# EAGLE design Teensy3 based M&M board V4 (EAGLE 6.5.0)
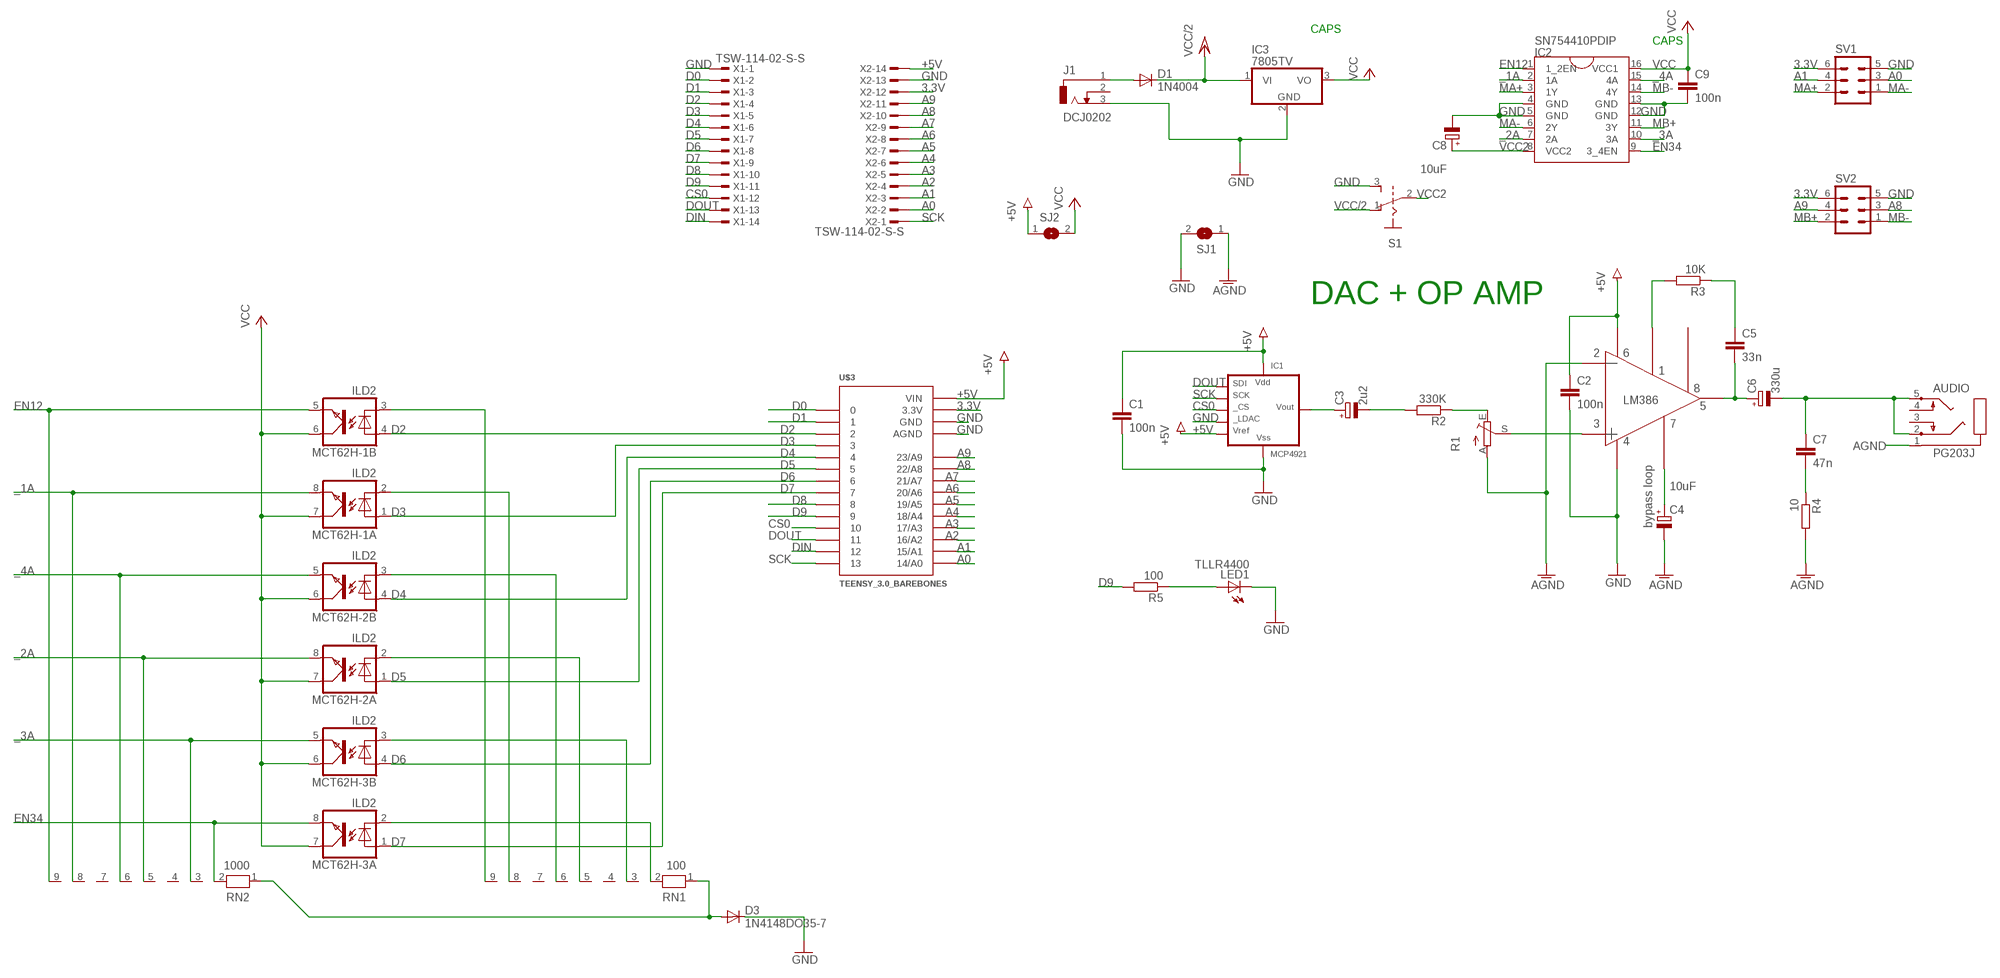
[diagram p0: schematic, sheet 1]

## Parts
AUDIO  PG203J  [PG203J]
C1  100n  C-EU050-030X075  [C050-030X075]
C2  100n  C-EU050-030X075  [C050-030X075]
C3  2u2  CPOL-EUE2-5  [E2-5]
C4  10uF  CPOL-EUE2-5  [E2-5]
C5  33n  C-EU050-030X075  [C050-030X075]
C6  330u  CPOL-EUE2.5-7  [E2,5-7]
C7  47n  C-EU050-030X075  [C050-030X075]
C8  10uF  CPOL-EUE2-5  [E2-5]
C9  100n  C-EU050-030X075  [C050-030X075]
D1  1N4004  [DO41-10]
D3  1N4148DO35-7  [DO35-7]
IC1  MCP4921  MCP4921P  [DIL8]
IC2  SN754410PDIP  [DIL16]
IC3  7805TV  [TO220V]
J1  DCJ0202  [DCJ0202]
LED1  TLLR4400  [LED3MM]
MCT62H-1  ILD2  [DIL08]
MCT62H-2  ILD2  [DIL08]
MCT62H-3  ILD2  [DIL08]
R1  TRIM_EU-CA9V  [CA9V]
R2  330K  R-EU_0207/10  [0207/10]
R3  10K  R-EU_0207/10  [0207/10]
R4  10  R-EU_0207/10  [0207/10]
R5  100  R-EU_0207/10  [0207/10]
RN1  100  RN08  [RN-9]
RN2  1000  RN08  [RN-9]
S1  EG1218  [GF-126-0159]
SJ1  SJ  [SJ]
SJ2  SJ  [SJ]
SV1  ML6  [ML6]
SV2  ML6  [ML6]
U$2  LM386  LM386OA  [LM386]
U$3  TEENSY_3.0_BAREBONES  [TEENSY_3.0_BAREBONES]
X1  TSW-114-02-S-S  [TSW-114-02-S-S]
X2  TSW-114-02-S-S  [TSW-114-02-S-S]

## Nets
3.3V [power]: SV1.6 SV2.6 U$3.3.3V X2.12
+5V [power]: C1.1 C2.1 IC1.1(VDD) IC1.6(VREF) SJ2.1 U$2.6 U$3.VIN X2.14
_1A: IC2.2(1A) MCT62H-1.8(A:EMIT) RN2.8
_2A: IC2.7(2A) MCT62H-2.8(A:EMIT) RN2.5
_3A: IC2.10(3A) MCT62H-3.5(B:EMIT) RN2.3
_4A: IC2.15(4A) MCT62H-2.5(B:EMIT) RN2.6
A0: SV1.3 U$3.14/A0 X2.2
A1: SV1.4 U$3.15/A1 X2.3
A2: U$3.16/A2 X2.4
A3: U$3.17/A3 X2.5
A4: U$3.18/A4 X2.6
A5: U$3.19/A5 X2.7
A6: U$3.20/A6 X2.8
A7: U$3.21/A7 X2.9
A8: SV2.3 U$3.22/A8 X2.10
A9: SV2.4 U$3.23/A9 X2.11
AGND [power]: AUDIO.1 C4.- R1.A R4.2 SJ1.1 U$2.2
AMP_IN: R1.S U$2.3
CS0: IC1.2(CS) U$3.10 X1.12
D0: U$3.0 X1.2
D1: U$3.1 X1.3
D2: MCT62H-1.4(B:A) U$3.2 X1.4
D3: MCT62H-1.1(A:A) U$3.3 X1.5
D4: MCT62H-2.4(B:A) U$3.4 X1.6
D5: MCT62H-2.1(A:A) U$3.5 X1.7
D6: MCT62H-3.4(B:A) U$3.6 X1.8
D7: MCT62H-3.1(A:A) U$3.7 X1.9
D8: U$3.8 X1.10
D9: R5.2 U$3.9 X1.11
DIN: U$3.12 X1.14
DOUT: IC1.4(SDI) U$3.11 X1.13
EN12: IC2.1(1_2EN) MCT62H-1.5(B:EMIT) RN2.9
EN34: IC2.9(3_4EN) MCT62H-3.8(A:EMIT) RN2.2
GND [power]: C1.2 C2.2 C8.- C9.2 D3.C IC1.5(LDAC) IC1.7(VSS) IC2.4(GND) IC2.5(GND) IC2.12(GND) IC2.13(GND) IC3.2(GND) J1.3 LED1.K(C) S1.3 SJ1.2 SV1.5 SV2.5 U$2.4 U$3.AGND U$3.GND X1.1 X2.13
MA+: IC2.3(1Y) SV1.2
MA-: IC2.6(2Y) SV1.1
MB+: IC2.11(3Y) SV2.2
MB-: IC2.14(4Y) SV2.1
N$1: D1.A J1.1
N$2: R3.2 U$2.1
N$3: C3.+ IC1.8(VOUT)
N$4: C3.- R2.2
N$5: LED1.A R5.1
N$6: R1.E R2.1
N$7: D3.A RN1.1 RN2.1
N$9: C5.1 R3.1
N$10: C4.+ U$2.7
N$13: MCT62H-3.2(A:C) RN1.2
N$14 [power]: MCT62H-1.3(B:C) RN1.9
N$16 [power]: MCT62H-1.2(A:C) RN1.8
N$17 [power]: MCT62H-2.3(B:C) RN1.6
N$18 [power]: MCT62H-2.2(A:C) RN1.5
N$19 [power]: MCT62H-3.3(B:C) RN1.3
N$78: C7.2 R4.1
N$84: AUDIO.2 AUDIO.5 C6.- C7.1
N$99: C5.2 C6.+ U$2.5
SCK: IC1.3(SCK) U$3.13 X2.1
VCC: C9.1 IC2.16(VCC1) IC3.3(VO) MCT62H-1.6(B:COL) MCT62H-1.7(A:COL) MCT62H-2.6(B:COL) MCT62H-2.7(A:COL) MCT62H-3.6(B:COL) MCT62H-3.7(A:COL) SJ2.2
VCC2: C8.+ IC2.8(VCC2) S1.2
VCC/2: D1.C IC3.1(VI) S1.1
Unconnected: AUDIO.3 AUDIO.4 J1.2 RN1.4 RN1.7 RN2.4 RN2.7 U$2.8

## Notes on the sheet
- CAPS
- CAPS
- DAC + OP AMP
- bypass loop

## Library data of the parts
AUDIO = con-hirschmann:PG203J: MIC/HEADPHONE JACK KS-S stereo microphone/headphone jack PG203JN (Schukat)
C1 C2 C5 C7 C9 = rcl:C-EU: CAPACITOR, European symbol
C3 C4 C6 C8 = rcl:CPOL-EU: POLARIZED CAPACITOR, European symbol
D1 = diode:1N4004: DIODE general purpose rectifier, 1 A
D3 = diode:1N4148: DIODE high speed (Philips)
IC1 = microchip-dac:MCP4921: MCP4921: 12-bit DAC MCP4901/4911/4921 - 8/10/12-Bit Voltage Output Digital-to-Analog Converter with SPI Interface Interface The MCP49x1 devices are single channel 8-bit, 10-bit and 12-bit buffered voltage output Digital-to-Analog Converters (DACs), respectively. The devices operate from a single 2.7V to 5.5V supply with an SPI compatible Serial Peripheral Interface. The user can configure the full-scale range of the device to be VREF or 2*VREF by setting the Gain Selection Option bit (gain of 1 of 2). RobG
IC2 = AlexW-Eagle-Libraries:SN754410
IC3 = linear:78*: Positive VOLTAGE REGULATOR Source: http://cache.national.com/ds/LM/LM78L05.pdf http://www.fairchildsemi.com/ds/LM/LM7805.pdf
J1 = con-jack:DCJ0202: DC POWER JACK Source: DCJ0202.pdf; OC_FARNELL: unknown; OC_NEWARK: unknown
LED1 = led:TLLR4400: Low Current (2mA) LED 3 mm Tinted Diffused Package color RED Source: Data sheet <http://www.farnell.com/datasheets/391100.pdf>; MF: VISHAY SEMICONDUCTOR; OC_FARNELL: 1612437
MCT62H-1-MCT62H-3 = optocoupler:ILD2: SIEMENS OPTO COUPLER; OC_FARNELL: 1469596; OC_NEWARK: unknown
R1 = pot:TRIM_EU-: POTENTIOMETER
R2-R5 = rcl:R-EU_: RESISTOR, European symbol
RN1 RN2 = resistor-net:RN08: RESISTOR NETWORK; OC_FARNELL: unknown; OC_NEWARK: unknown
S1 = videomusik:EG1218
SJ1 SJ2 = jumper:SJ: SMD solder JUMPER
SV1 SV2 = con-harting-ml:ML6: HARTING; OC_FARNELL: unknown; OC_NEWARK: unknown
U$2 = blushingboy_experimental:LM386
U$3 = Teensy3.0:TEENSY_3.0_BAREBONES
X1 X2 = con-samtec:TSW-114-02-S-S: THROUGH-HOLE .025" SQ POST HEADER Source: Samtec TSW.pdf; OC_FARNELL: unknown; OC_NEWARK: unknown

## Net classes
1 power: width 0.61 mm

## Board
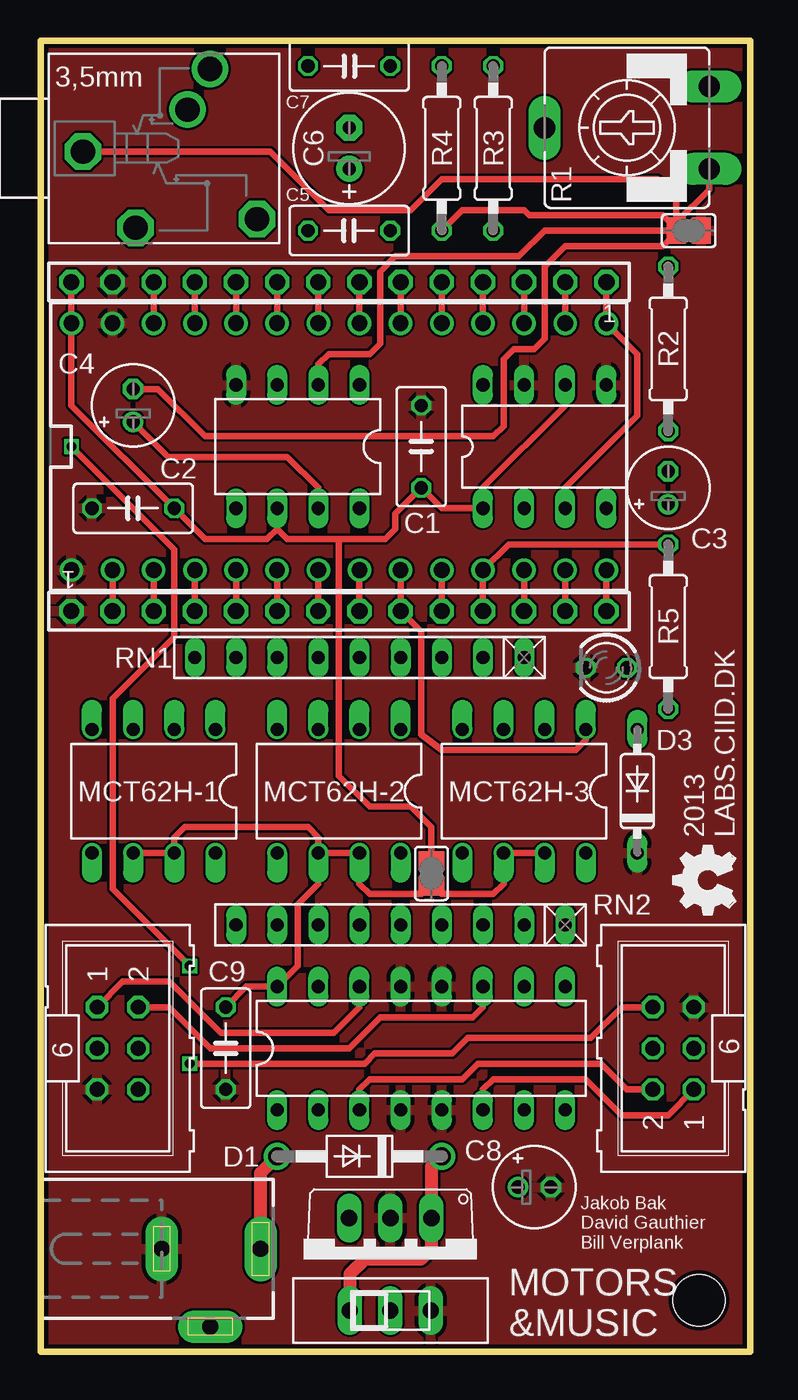
[diagram p1: board, top side]
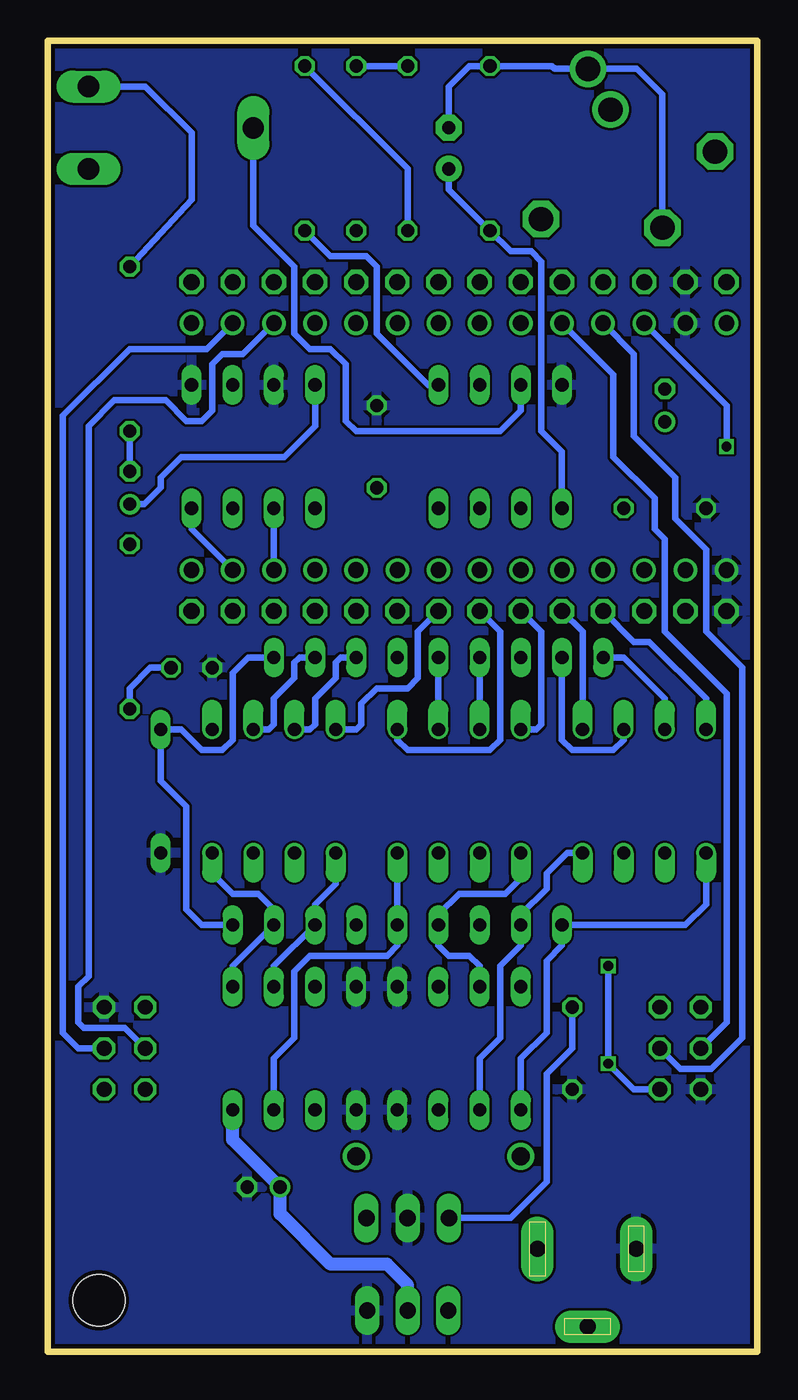
[diagram p2: board, bottom side, seen from below]

Size 43.8 x 80.95 mm. Coordinates in mm from the lower left corner, seen from the top.
Outline: 0,0 43.8,0 43.8,80.95 0,80.95 0,0
Copper layers (1*2*15*16): Top 0.035mm / dielectric 0.2mm / layer 2 0.0175mm / dielectric 1.1mm / layer 15 0.0175mm / dielectric 0.2mm / Bottom 0.035mm
Design rules "SeeedStudio_DRU_no_angle_20130527": minimum track width 6mil, minimum drill 12mil, track to track 6mil, track to pad 6mil, pad to pad 6mil, via to via 6mil, smd to smd 0mil, copper to edge 10mil, drill to drill 10mil, minimum pad ring 6mil, minimum via ring 6mil, stop-mask expansion 2mil, vias tented up to drill 25mil, thermal gap 10mil
Holes 3.2 mm at 40.64,3.17

### Footprints (pad centres in the part's own frame; a part is rotated, then mirrored left to right if it is on the bottom)
PG203J = drill 1.499 octagon: 1 -5.004,-0.203; 4 5.74,-4.369; 5 -1.753,-4.902 | drill 1.499: 2 2.845,4.902; 3 1.448,2.388
C050-030X075 = drill 0.813 octagon: 1 -2.54,0; 2 2.54,0
E2-5 = drill 0.813 pad 1.27: + -1.016,0 | drill 0.813 pad 1.27 octagon: - 1.016,0
E2,5-7 = drill 0.813 pad 1.6: + -1.27,0 | drill 0.813 pad 1.6 octagon: - 1.27,0
DO41-10 = drill 1.118: A 5.08,0; C -5.08,0
DO35-7 = drill 0.813 long: A 3.81,0; C -3.81,0
DIL8 = drill 0.813 long: 1 -3.81,-3.81; 2 -1.27,-3.81; 3 1.27,-3.81; 4 3.81,-3.81; 5 3.81,3.81; 6 1.27,3.81; 7 -1.27,3.81; 8 -3.81,3.81
DIL16 = drill 0.813 long: 1 -8.89,-3.81; 2 -6.35,-3.81; 3 -3.81,-3.81; 4 -1.27,-3.81; 5 1.27,-3.81; 6 3.81,-3.81; 7 6.35,-3.81; 8 8.89,-3.81; 9 8.89,3.81; 10 6.35,3.81; 11 3.81,3.81; 12 1.27,3.81; 13 -1.27,3.81; 14 -3.81,3.81; 15 -6.35,3.81; 16 -8.89,3.81
TO220V = drill 1.016 long: 1 -2.54,-2.54; 2 0,-2.54; 3 2.54,-2.54
DCJ0202 = drill 1 pad 2 long: 1 0,3.1; 2 4.8,0; 3 0,-3
LED3MM = drill 0.813 octagon: A -1.27,0; K 1.27,0
DIL08 = drill 0.813 offset: 1 -3.81,-3.81; 2 -1.27,-3.81; 3 1.27,-3.81; 4 3.81,-3.81; 5 3.81,3.81; 6 1.27,3.81; 7 -1.27,3.81; 8 -3.81,3.81
CA9V = drill 1.321 long: A -2.54,-5.08; E 2.54,-5.08; S 0,5.08
0207/10 = drill 0.813 octagon: 1 -5.08,0; 2 5.08,0
RN-9 = drill 0.813 long: 1 -10.16,0; 2 -7.62,0; 3 -5.08,0; 4 -2.54,0; 5 0,0; 6 2.54,0; 7 5.08,0; 8 7.62,0; 9 10.16,0
GF-126-0159 = drill 1 long: 1 -2.5,0; 2 0,0; 3 2.5,0
SJ = smd 1.168 x 1.6: 1 -0.762,0; 2 0.762,0
ML6 = drill 0.914 octagon: 1 -2.54,-1.27; 2 -2.54,1.27; 3 0,-1.27; 4 0,1.27; 5 2.54,-1.27; 6 2.54,1.27
LM386 = drill 0.813 long: 1 2.54,-2.54; 2 5.08,-2.54; 3 7.62,-2.54; 4 10.16,-2.54; 5 10.16,5.08; 6 7.62,5.08; 7 5.08,5.08; 8 2.54,5.08
TEENSY_3.0_BAREBONES = drill 0.965: 0 -7.62,13.97; 1 -7.62,11.43; 2 -7.62,8.89; 3 -7.62,6.35; 3.3V 7.62,11.43; 4 -7.62,3.81; 5 -7.62,1.27; 6 -7.62,-1.27; 7 -7.62,-3.81; 8 -7.62,-6.35; 9 -7.62,-8.89; 10 -7.62,-11.43; 11 -7.62,-13.97; 12 -7.62,-16.51; 13 7.62,-16.51; 14/A0 7.62,-13.97; 15/A1 7.62,-11.43; 16/A2 7.62,-8.89; 17/A3 7.62,-6.35; 18/A4 7.62,-3.81; 19/A5 7.62,-1.27; 20/A6 7.62,1.27; 21/A7 7.62,3.81; 22/A8 7.62,6.35; 23/A9 7.62,8.89; AGND 7.62,13.97; GND -7.62,16.51; VIN 7.62,16.51
TSW-114-02-S-S = drill 1 pad 1.5 octagon: 1 16.51,0; 2 13.97,0; 3 11.43,0; 4 8.89,0; 5 6.35,0; 6 3.81,0; 7 1.27,0; 8 -1.27,0; 9 -3.81,0; 10 -6.35,0; 11 -8.89,0; 12 -11.43,0; 13 -13.97,0; 14 -16.51,0

### Placement (x,y rotation side)
AUDIO  7.62,74.3 0 top
C1  23.5,55.88 90 top
C2  5.71,52.07 180 top
C3  38.73,53.34 90 top
C4  5.71,58.42 90 top
C5  19.05,69.22 180 top
C6  19.05,74.3 90 top
C7  19.05,79.38 0 top
C8  30.48,10.16 0 top
C9  11.43,18.73 270 top
D1  19.68,12.06 180 top
D3  36.83,34.61 90 top
IC1  31.11,55.88 0 top
IC2  23.5,18.73 0 top
IC3  21.59,5.71 180 top
J1  10.48,6.35 270 top
LED1  34.92,42.23 180 top
MCT62H-1  6.99,34.61 180 top
MCT62H-2  18.41,34.61 180 top
MCT62H-3  29.84,34.61 180 top
R1  36.2,75.56 90 top
R2  38.73,61.91 270 top
R3  27.94,74.3 270 top
R4  24.77,74.3 270 top
R5  38.73,44.77 90 top
RN1  19.68,42.86 180 top
RN2  22.23,26.35 180 top
S1  21.59,2.54 0 top
SJ1  40.01,69.22 0 top
SJ2  24.13,29.53 270 top
SV1  39.05,18.73 90 top
SV2  4.76,18.73 270 top
U$1  [OSHW_FILLX150_NOTEXT]  42.86,26.99 90 top
U$2  22.23,57.15 180 top
U$3  18.41,55.88 90 top
X1  18.41,45.72 180 top
X2  18.41,66.04 0 top

### Tracks (layer width: path | path; a pad name or v marks a point on that pad's centre or on a via)
3.3V  (via drill 0.6)
  Top 0.406: X2.12 U$3.3.3V | v1.91,55.88 8.26,49.53 8.26,44.13 4.45,40.32 4.45,28.57 v9.21,23.81 | SV1.6 35.88,21.27 33.97,19.37 26.35,19.37 25.4,18.41 20.64,18.41 20,17.78 v9.21,17.78
  Bottom 0.406: U$3.3.3V 1.91,58.42 v1.91,55.88 | SV2.6 7.62,16.19 v9.21,17.78 v9.21,23.81
+5V
  Top 0.406: X2.14 U$3.VIN 1.91,58.42 C2.1 10.16,50.16 13.97,50.16 14.61,50.8 | IC1.6 32.38,58.42 27.3,53.34 IC1.1 24.77,52.07 C1.1 21.91,51.75 21.91,50.8 21.27,50.16 18.41,50.16 | 14.61,50.8 U$2.6 | 18.41,50.16 15.24,50.16 14.61,50.8 | 18.41,50.16 18.41,35.56 20.32,33.66 22.86,33.66 24.13,32.38 SJ2.1 24.13,28.57
_1A
  Bottom 0.406: MCT62H-1.8 11.75,30.8 13.02,29.53 13.02,28.57 14.61,26.99 RN2.8 14.61,25.08 15.88,23.81 15.88,19.37 17.14,18.1 IC2.2
_2A
  Bottom 0.406: MCT62H-2.8 RN2.5 22.23,25.08 22.86,24.45 27.62,24.45 28.57,23.5 28.57,19.37 29.84,18.1 IC2.7
_3A
  Bottom 0.406: MCT62H-3.5 26.04,28.89 27.3,27.62 RN2.3 29.84,23.81 IC2.10
_4A
  Bottom 0.406: MCT62H-2.5 14.61,29.21 15.56,28.26 18.41,28.26 19.68,26.99 RN2.6 19.68,25.08 19.05,24.45 17.78,24.45 17.14,23.81 IC2.15
A0
  Top 0.406: X2.2 U$3.14/A0
  Bottom 0.406: U$3.14/A0 33.97,61.91 38.73,61.91 42.86,57.78 42.86,19.68 41.91,18.73 SV1.3
A1
  Top 0.406: X2.3 U$3.15/A1
  Bottom 0.406: U$3.15/A1 31.75,61.59 33.02,61.59 33.66,60.96 33.66,58.1 34.29,57.47 35.24,57.47 36.51,58.74 39.69,58.74 41.27,57.15 41.27,23.18 41.91,22.54 41.91,20.32 41.59,20 39.05,20 SV1.4
A2
  Top 0.406: X2.4 U$3.16/A2
A3
  Top 0.406: X2.5 U$3.17/A3
A4
  Top 0.406: X2.6 U$3.18/A4
A5
  Top 0.406: X2.7 U$3.19/A5
A6
  Top 0.406: X2.8 U$3.20/A6
A7
  Top 0.406: X2.9 U$3.21/A7
A8
  Top 0.406: X2.10 U$3.22/A8
  Bottom 0.406: U$3.22/A8 8.89,60.33 8.89,55.24 6.35,52.7 6.35,50.8 5.71,50.16 5.71,44.45 1.91,40.64 1.91,20.32 SV2.3
A9
  Top 0.406: X2.11 U$3.23/A9
  Bottom 0.406: U$3.23/A9 7.62,61.59 7.62,56.52 5.08,53.98 5.08,51.44 3.17,49.53 3.17,44.45 0.95,42.23 0.95,19.37 2.86,17.46 4.76,17.46 SV2.4
AGND
  Top 0.406: AUDIO.1 14.17,74.09 17.78,70.48 22.86,70.48 24.77,72.39 38.1,72.39 39.24,71.25 SJ1.1 | U$2.2 17.14,60.96 17.78,61.59 20.32,61.59 20.95,62.23 20.95,66.67 21.91,67.63 29.53,67.63 31.11,69.22 SJ1.1 | C4.- 7.24,59.44 10.16,56.52 27.94,56.52 28.57,57.15 28.57,61.28 29.21,61.91 30.48,61.91 31.11,62.55 31.11,66.99 32.38,68.26 38.42,68.26 39.24,69.09 SJ1.1 | 40.64,69.22 SJ1.1 | R4.2 26.04,70.48 29.84,70.48 30.16,70.17 38.42,70.17 39.24,69.34 SJ1.1 | R1.A 41.27,71.75 39.24,69.72 SJ1.1
AMP_IN
  Bottom 0.406: U$2.3 14.61,58.1 15.88,56.83 24.77,56.83 25.4,57.47 25.4,60.96 26.35,61.91 27.62,61.91 28.57,62.87 28.57,66.99 31.11,69.53 R1.S
CS0
  Top 0.406: U$3.10 X1.12
  Bottom 0.406: U$3.10 IC1.2
D0
  Top 0.406: U$3.0 X1.2
D1
  Top 0.406: U$3.1 X1.3
D2
  Top 0.406: U$3.2 X1.4
  Bottom 0.406: MCT62H-1.4 3.17,40.32 6.67,43.81 7.62,43.81 X1.4
D3
  Top 0.406: U$3.3 X1.5
  Bottom 0.406: MCT62H-1.1 10.79,44.45 X1.5
D4
  Top 0.406: U$3.4 X1.6
  Bottom 0.406: MCT62H-2.4 13.65,38.42 13.34,38.73 13.34,44.45 X1.6
D5
  Top 0.406: U$3.5 X1.7
  Bottom 0.406: MCT62H-2.1 22.23,37.78 21.59,37.15 16.51,37.15 15.88,37.78 15.88,44.45 X1.7
D6
  Top 0.406: U$3.6 X1.8
  Bottom 0.406: MCT62H-3.4 24.77,38.42 24.45,38.73 24.45,40.01 23.5,40.96 21.59,40.96 20.95,41.59 20.95,44.45 X1.8
D7
  Top 0.406: MCT62H-3.1 33.66,37.78 33.02,37.15 24.77,37.15 23.5,38.1 23.5,44.45 X1.9 U$3.7
D8
  Top 0.406: U$3.8 X1.10
D9
  Top 0.406: X1.11 U$3.9 28.89,49.85 R5.2
DIN
  Top 0.406: U$3.12 X1.14
DOUT
  Top 0.406: U$3.11 X1.13
  Bottom 0.406: U$3.11 34.92,50.8 IC1.4
EN12
  Bottom 0.406: MCT62H-1.5 3.17,27.62 4.45,26.35 RN2.9 12.06,25.08 13.02,24.13 13.02,19.68 14.61,18.1 IC2.1
EN34
  Bottom 0.406: MCT62H-3.8 33.66,29.53 32.38,28.26 30.8,28.26 29.84,27.3 RN2.2 32.38,23.81 IC2.9
GND
  pour Bottom: -1.91,-0.95 -1.91,82.23 50.8,82.23 50.8,-0.95
  pour Top: -0.95,81.6 -0.95,-0.95 50.8,-0.95 50.8,81.6
MA+
  Top 0.406: IC2.3 19.68,16.19 20.32,16.83 26.04,16.83 26.99,17.78 34.61,17.78 36.2,16.19 SV1.2
MA-
  Top 0.406: IC2.6 27.3,16.19 27.94,16.83 33.66,16.83 35.88,14.61 38.73,14.61 SV1.1
MB+
  Top 0.406: IC2.11 27.3,21.27 26.67,20.64 20.95,20.64 19.05,18.73 10.48,18.73 7.94,21.27 SV2.2
MB-
  Top 0.406: IC2.14 19.68,21.27 18.1,19.68 11.11,19.68 7.94,22.86 5.08,22.86 SV2.1
N$1
  Top 0.813: J1.1 13.58,11.04 D1.A
N$2
  Bottom 0.406: U$2.1 20.32,59.69 23.5,62.87 23.5,66.99 24.13,67.63 26.35,67.63 R3.2
N$3
  Bottom 0.406: IC1.8 27.3,57.15 29.21,55.24 35.56,55.24 36.83,53.98 36.83,53.34 37.85,52.32 C3.+
N$4
  Bottom 0.406: R2.2 C3.-
N$5
  Bottom 0.406: R5.1 38.73,40.96 37.47,42.23 LED1.A
N$6
  Bottom 0.406: R2.1 34.92,71.12 34.92,75.25 37.78,78.11 R1.E
N$7
  Bottom 0.406: RN1.1 31.43,42.86 32.38,41.91 32.38,37.78 33.02,37.15 34.29,37.15 35.56,38.42 D3.A 36.83,35.24 35.24,33.66 35.24,27.3 34.29,26.35 RN2.1
N$9
  Bottom 0.406: C5.1 21.59,73.03 R3.1
N$10
  Top 0.406: U$2.7 17.14,53.34 15.24,55.24 7.87,55.24 C4.+
N$13
  Bottom 0.406: MCT62H-3.2 30.16,38.42 29.84,38.73 29.84,40.32 28.57,41.59 28.57,42.55 28.26,42.86 RN1.2
N$14
  Bottom 0.406: RN1.9 8.26,42.86 5.71,40.32 MCT62H-1.3
N$16
  Bottom 0.406: MCT62H-1.2 8.26,37.78 8.89,37.15 11.43,37.15 12.06,37.78 RN1.8
N$17
  Bottom 0.406: MCT62H-2.3 RN1.6
N$18
  Bottom 0.406: RN1.5 MCT62H-2.2
N$19
  Bottom 0.406: MCT62H-3.3 27.62,38.42 27.3,38.73 27.3,40.32 26.04,41.59 26.04,42.55 25.72,42.86 RN1.3
N$78
  Bottom 0.406: C7.2 R4.1
N$84
  Bottom 0.406: C6.- 19.05,78.11 17.78,79.38 C7.1 12.7,79.38 12.52,79.2 AUDIO.2 7.44,79.2 5.87,77.62 AUDIO.5
N$99
  Bottom 0.406: C6.+ 19.05,71.75 C5.2 15.24,67.94 13.97,67.94 13.34,67.31 13.34,56.83 12.06,55.56 U$2.5
SCK
  Top 0.406: X2.1 U$3.13 36.83,61.59 36.83,57.78 32.38,53.34 IC1.3
VCC
  Top 0.406: MCT62H-3.7 MCT62H-3.6 28.57,28.89 27.94,28.26 24.77,28.26 24.26,28.77 SJ2.2 24,28.77 23.5,28.26 20.32,28.26 19.68,28.89 MCT62H-2.7 MCT62H-2.6 | MCT62H-2.6 17.14,31.75 16.51,32.38 8.89,32.38 8.26,31.75 MCT62H-1.7 MCT62H-1.6 | MCT62H-2.6 17.14,28.89 15.88,27.62 15.88,23.81 IC2.16 12.7,22.54 C9.1
  Bottom 0.406: IC3.3 15.24,8.26 13.02,10.48 13.02,17.14 11.43,18.73 C9.1
VCC2
  Bottom 0.813: S1.2 21.59,4.13 22.86,5.4 26.35,5.4 29.46,8.51 C8.+ 32.38,13.08 IC2.8
VCC/2
  Top 0.813: D1.C 24.13,11.43 IC3.1 24.13,6.35 23.5,5.71 20,5.71 19.09,4.8 S1.1

### Text on the board
tNames: 2013 / LABS.CIID.DK | Jakob Bak / David Gauthier / Bill Verplank | MOTORS / &MUSIC